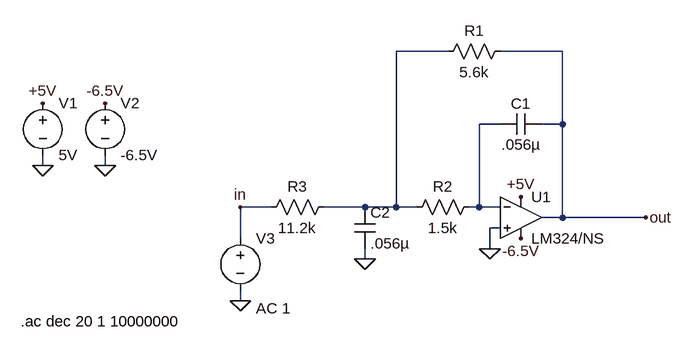
[diagram p0: schematic MFB_Maybe_Wrong_K (used positive value).asc]
MFB_Maybe_Wrong_K (used positive value).asc, the LTspice schematic file:
Version 4
SHEET 1 880 680
WIRE 288 -32 208 -32
WIRE 464 -32 368 -32
WIRE 368 80 336 80
WIRE 464 80 464 -32
WIRE 464 80 432 80
WIRE -336 144 -336 128
WIRE -240 144 -240 128
WIRE 16 208 -32 208
WIRE 160 208 96 208
WIRE 208 208 208 -32
WIRE 208 208 160 208
WIRE 240 208 208 208
WIRE 336 208 336 80
WIRE 336 208 320 208
WIRE 368 208 336 208
WIRE 464 224 464 80
WIRE 464 224 432 224
WIRE 592 224 464 224
WIRE 368 240 352 240
WIRE -32 256 -32 208
WIRE 352 272 352 240
WIRE 160 288 160 272
WIRE -32 352 -32 336
FLAG -240 144 0
FLAG -336 144 0
FLAG -336 48 +5V
FLAG 400 192 +5V
FLAG -240 48 -6.5V
FLAG 400 256 -6.5V
FLAG 352 272 0
FLAG 160 288 0
FLAG -32 352 0
FLAG -32 208 in
FLAG 592 224 out
SYMBOL ZZZ\\OpAmp\\LM324 400 224 R0
SYMATTR InstName U1
SYMBOL voltage -336 32 R0
WINDOW 123 0 0 Left 0
WINDOW 39 0 0 Left 0
SYMATTR InstName V1
SYMATTR Value 5V
SYMBOL voltage -240 32 R0
WINDOW 123 0 0 Left 0
WINDOW 39 0 0 Left 0
SYMATTR InstName V2
SYMATTR Value -6.5V
SYMBOL cap 432 64 R90
WINDOW 0 0 32 VBottom 2
WINDOW 3 32 32 VTop 2
SYMATTR InstName C1
SYMATTR Value .056µ
SYMBOL res 384 -48 R90
WINDOW 0 0 56 VBottom 2
WINDOW 3 32 56 VTop 2
SYMATTR InstName R1
SYMATTR Value 5.6k
SYMBOL res 336 192 R90
WINDOW 0 0 56 VBottom 2
WINDOW 3 32 56 VTop 2
SYMATTR InstName R2
SYMATTR Value 1.5k
SYMBOL cap 144 208 R0
SYMATTR InstName C2
SYMATTR Value .056µ
SYMBOL res 0 224 R270
WINDOW 0 32 56 VTop 2
WINDOW 3 0 56 VBottom 2
SYMATTR InstName R3
SYMATTR Value 11.2k
SYMBOL voltage -32 240 R0
WINDOW 123 24 124 Left 2
WINDOW 39 0 0 Left 0
SYMATTR InstName V3
SYMATTR Value ""
SYMATTR Value2 AC 1
TEXT -370 384 Left 2 !.ac dec 20 1 10000000

The netlist it stands for:
* MFB_Maybe_Wrong_K (used positive value).asc
XU1 0 N002 +5V -6.5V out LM324/NS  ; pins In+ In- V+ V- OUT
V1 +5V 0 5V
V2 -6.5V 0 -6.5V
C1 out N002 .056µ
R1 out N001 5.6k
R2 N002 N001 1.5k
C2 N001 0 .056µ
R3 in N001 11.2k
V3 in 0 AC 1
.ac dec 20 1 10000000
.backanno
.end